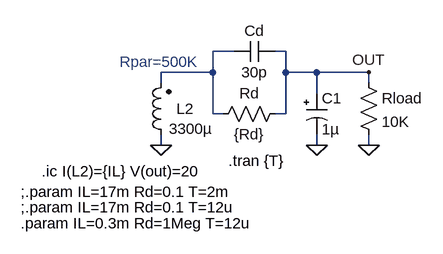
[diagram p0: schematic FlyBackRevers2.asc]
FlyBackRevers2.asc, the LTspice schematic file:
Version 4
SHEET 1 2376 1416
WIRE 1824 800 1792 800
WIRE 1904 800 1888 800
WIRE 1792 832 1792 800
WIRE 1792 832 1712 832
WIRE 1904 832 1904 800
WIRE 1952 832 1904 832
WIRE 2032 832 1952 832
WIRE 1712 848 1712 832
WIRE 2032 848 2032 832
WIRE 1952 864 1952 832
WIRE 1792 896 1792 832
WIRE 1808 896 1792 896
WIRE 1904 896 1904 832
WIRE 1904 896 1888 896
WIRE 1712 944 1712 928
WIRE 1952 944 1952 928
WIRE 2032 944 2032 928
FLAG 2032 832 OUT
FLAG 1952 944 0
FLAG 2032 944 0
FLAG 1712 944 0
SYMBOL POLCAP 1936 864 R0
SYMATTR InstName C1
SYMATTR Value 1µ
SYMATTR SpiceLine Rser=0.02
SYMBOL res 2016 832 R0
SYMATTR InstName Rload
SYMATTR Value 10K
SYMBOL ind2 1728 944 R180
WINDOW 0 -35 56 Left 0
WINDOW 3 -64 25 Left 0
SYMATTR InstName L2
SYMATTR Value 3300µ
SYMATTR Type ind
SYMATTR SpiceLine Rpar=500K
SYMBOL cap 1888 784 R90
WINDOW 0 0 32 VBottom 0
WINDOW 3 32 32 VTop 0
SYMATTR InstName Cd
SYMATTR Value 30p
SYMBOL res 1904 880 R90
WINDOW 0 0 56 VBottom 0
WINDOW 3 32 56 VTop 0
SYMATTR InstName Rd
SYMATTR Value {Rd}
TEXT 1816 968 Left 0 !.tran {T}
TEXT 1528 984 Left 0 !.ic I(L2)={IL} V(out)=20
TEXT 1496 1040 Left 0 !;.param IL=17m Rd=0.1 T=12u
TEXT 1496 1064 Left 0 !.param IL=0.3m Rd=1Meg T=12u
TEXT 1496 1016 Left 0 !;.param IL=17m Rd=0.1 T=2m
TEXT 1648 816 Left 0 ;Rpar=500K

The netlist it stands for:
* FlyBackRevers2.asc
C1 OUT 0 1µ Rser=0.02
Rload OUT 0 10K
L2 0 N001 3300µ Rpar=500K
Cd OUT N001 30p
Rd OUT N001 {Rd}
.tran {T}
.ic I(L2)={IL} V(out)=20
;.param IL=17m Rd=0.1 T=12u
.param IL=0.3m Rd=1Meg T=12u
;.param IL=17m Rd=0.1 T=2m
* Rpar=500K
.backanno
.end